# Altium schematic sheet Battery Pack & Charger.SchDoc
size A4
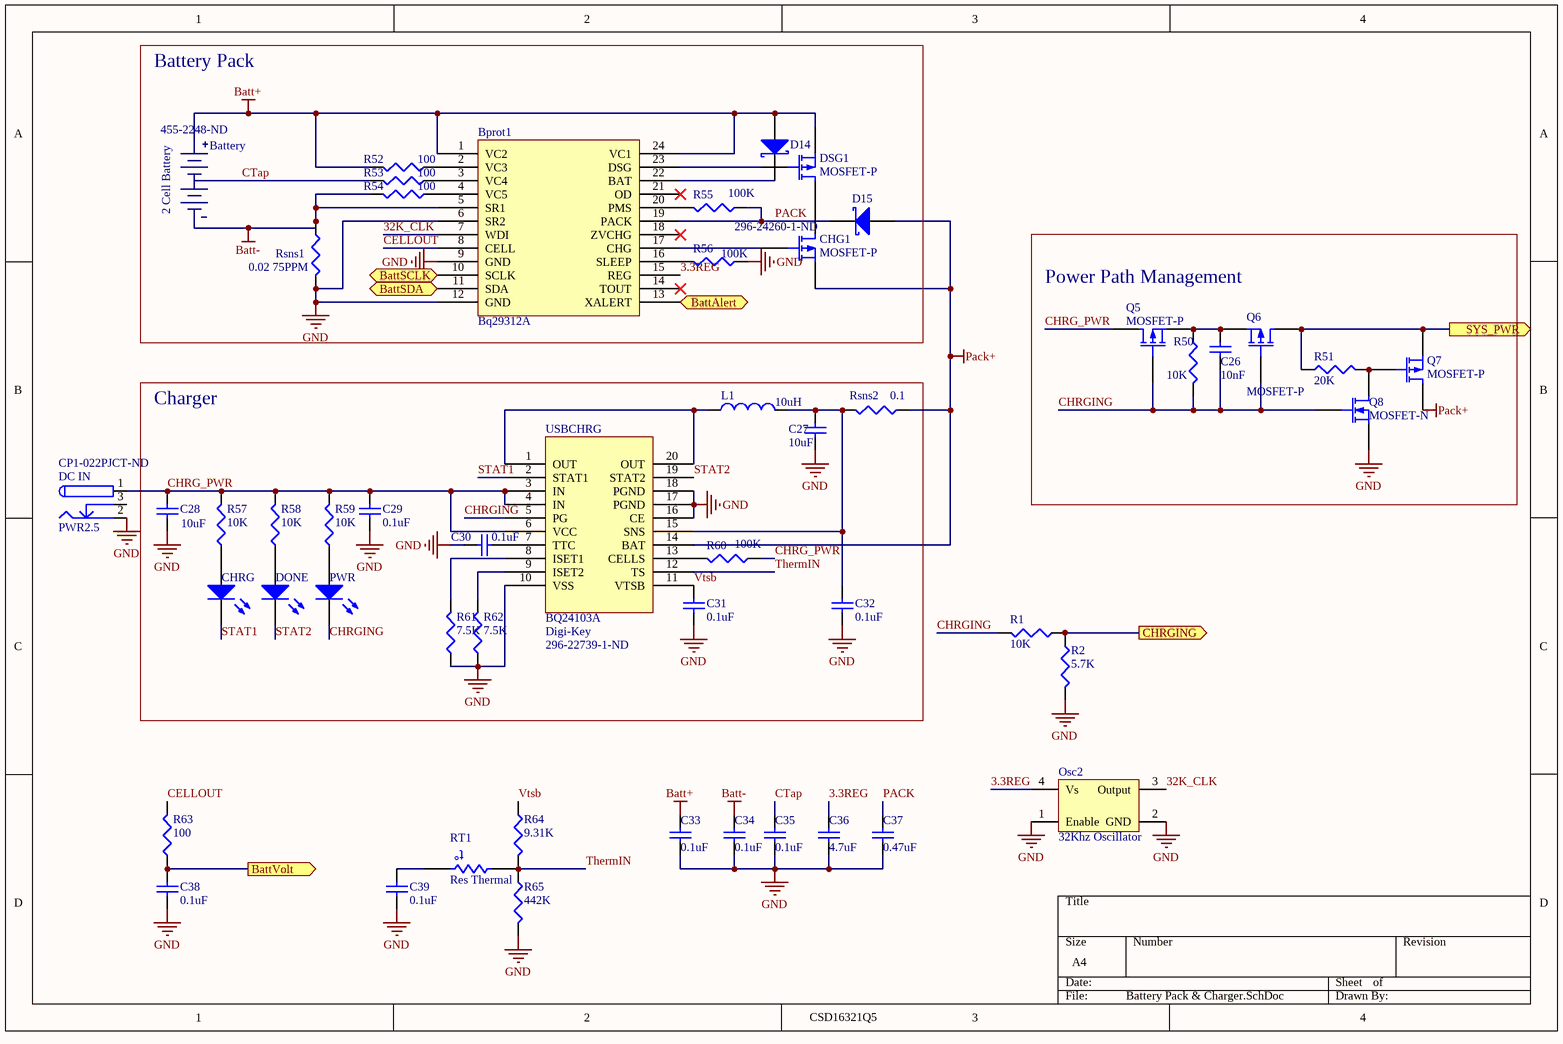
[diagram p0: Battery Pack & Charger.SchDoc]

## Parts
Battery  2 Cell Battery  Supplier Part Number 1: 455-2248-ND  [Turnigy Nanotech 2cell]
Bprot1  Bq29312A  [TSOP65P640X120-24N]
C26  value 10nF  [0603_CAP]  (hidden comment: X7R Cap)
C27  value 10uF  [0603_CAP]  (hidden comment: X7R Cap)
C28  value 10uF  [0603_CAP]  (hidden comment: X7R Cap)
C29  value 0.1uF  [0603_CAP]  (hidden comment: X7R Cap)
C30  value 0.1uF  [0603_CAP]  (hidden comment: X7R Cap)
C31  value 0.1uF  [0603_CAP]  (hidden comment: X7R Cap)
C32  value 0.1uF  [0603_CAP]  (hidden comment: X7R Cap)
C33  value 0.1uF  [0603_CAP]  (hidden comment: X7R Cap)
C34  value 0.1uF  [0603_CAP]  (hidden comment: X7R Cap)
C35  value 0.1uF  [0603_CAP]  (hidden comment: X7R Cap)
C36  value 4.7uF  [0603_CAP]  (hidden comment: X7R Cap)
C37  value 0.47uF  [0603_CAP]  (hidden comment: X7R Cap)
C38  value 0.1uF  [0603_CAP]  (hidden comment: X7R Cap)
C39  value 0.1uF  [0603_CAP]  (hidden comment: X7R Cap)
CHG1  MOSFET-P  [CSD16321Q5_PFET]
CHRG  LED0  [0603_RES]  (value not drawn)
D14  Diode 10TQ035  [DIODE]  (value not drawn)
D15  Diode 10TQ035  [DIODE]  (value not drawn)
DC_IN  PWR2.5  Supplier Part Number 1: CP1-022PJCT-ND  [DC Power JAck]
DONE  LED0  [0603_RES]  (value not drawn)
DSG1  MOSFET-P  [CSD16321Q5_PFET]
L1  value 10uH  [INDM7575X45N]  (hidden comment: Inductor)
Osc2  32Khz Oscillator  [Oscillator]
PWR  LED0  [0603_RES]  (value not drawn)
Q5  MOSFET-P  [CSD16321Q5_PFET]
Q6  MOSFET-P  [CSD16321Q5_PFET]
Q7  MOSFET-P  [CSD16321Q5_PFET]
Q8  MOSFET-N  [CSD16321Q5]
R1  value 10K  [0603_RES]  (hidden comment: Res3)
R2  value 5.7K  [0603_RES]  (hidden comment: Res3)
R50  value 10K  [0603_RES]  (hidden comment: Res3)
R51  value 20K  [0603_RES]  (hidden comment: Res3)
R52  value 100  [0603_RES]
R53  value 100  [0603_RES]
R54  value 100  [0603_RES]
R55  value 100K  [RESC1608L]
R56  value 100K  [RESC1608L]
R57  value 10K  [0603_RES]  (hidden comment: Res3)
R58  value 10K  [0603_RES]  (hidden comment: Res3)
R59  value 10K  [0603_RES]  (hidden comment: Res3)
R60  value 100K  [RESC1608L]
R61  value 7.5K  [0603_RES]
R62  value 7.5K  [0603_RES]
R63  value 100  [0603_RES]
R64  value 9.31K  [0603_RES]  (hidden comment: Rpull)
R65  value 442K  [0603_RES]  (hidden comment: Rpull)
Rsns1  value 0.02 75PPM  [CRA2512]
Rsns2  value 0.1  [CRA2512]  (hidden comment: Rpull)
RT1  Res Thermal  [RESC2012N]
USBCHRG  BQ24103A  Supplier 1: Digi-Key  [QFN50P350X450X100-20N]

## Blocks framed on the sheet
Battery Pack: Battery Bprot1 CHG1 D14 D15 DSG1 R52-R56 Rsns1
Power Path Management: C26 Q5-Q8 R50 R51
Charger: C27-C32 CHRG DONE L1 PWR R57-R62 Rsns2 USBCHRG

## Ports
BattAlert (out), BattSCLK (in), BattSDA (in), BattVolt (out), CHRGING (out), SYS_PWR (out)

## Nets
Batt+: Battery.1(+) Bprot1.1(VC2) Bprot1.24(VC1) C33.1 D14.1(A) DSG1.3(S) R52.2
Batt-: Battery.3(-) Bprot1.5(SR1) C34.1 R54.2 Rsns1.1
GND: Bprot1.6(SR2) Bprot1.9(GND) Bprot1.12(GND) C27.1 C28.1 C29.2 C30.1 C31.2 C32.2 C33.2 C34.2 C35.2 C36.2 C37.2 C38.1 C39.1 DC_IN.2 Osc2.1(Enable) Osc2.2(GND) Q8.3(S) R2.2 R56.1 R61.1 R62.1 R65.2 Rsns1.2 USBCHRG.10(VSS) USBCHRG.16(CE) USBCHRG.17(PGND) USBCHRG.18(PGND)
Pack+: CHG1.3(S) D15.2(A) Q7.1(D) Rsns2.1 USBCHRG.14(BAT)
3.3REG: Bprot1.15(REG) C36.1 Osc2.4(Vs)
32K_CLK: Bprot1.7(WDI) Osc2.3(Output)
BattAlert: Bprot1.13(XALERT) ; port BattAlert
BattSCLK: Bprot1.10(SCLK) ; port BattSCLK
BattSDA: Bprot1.11(SDA) ; port BattSDA
BattVolt: C38.2 R63.1 ; port BattVolt
CELLOUT: Bprot1.8(CELL) R63.2
CHRG_PWR: C28.2 C29.1 DC_IN.1 Q5.1(D) R57.2 R58.2 R59.2 R60.1 USBCHRG.3(IN) USBCHRG.4(IN) USBCHRG.6(VCC)
CHRGING: C26.1 PWR.2(K) Q5.2(G) Q6.2(G) Q8.2(G) R1.2 R50.2 USBCHRG.5(PG)
CHRGING: R1.1 R2.1 ; port CHRGING  [a separate net that carries the same name]
CTap: Battery.2(Ctap) C35.1 R53.2
PACK: Bprot1.19(PACK) C37.1 D15.1(K) R55.1
STAT1: CHRG.2(K) USBCHRG.2(STAT1)
STAT2: DONE.2(K) USBCHRG.19(STAT2)
SYS_PWR: Q6.1(D) Q7.3(S) R51.1 ; port SYS_PWR
ThermIN: R64.2 R65.1 RT1.2 USBCHRG.12(TS)
Vtsb: C31.1 R64.1 USBCHRG.11(VTSB)
NetBprot1_2: Bprot1.2(VC3) R52.1
NetBprot1_3: Bprot1.3(VC4) R53.1
NetBprot1_4: Bprot1.4(VC5) R54.1
NetBprot1_16: Bprot1.16(SLEEP) R56.2
NetBprot1_17: Bprot1.17(CHG) CHG1.2(G)
NetBprot1_20: Bprot1.20(PMS) R55.2
NetBprot1_22: Bprot1.22(BAT) D14.2(K)
NetBprot1_23: Bprot1.23(DSG) DSG1.2(G)
NetC26_2: C26.2 Q5.3(S) Q6.3(S) R50.1
NetC27_2: C27.2 C32.1 L1.2 Rsns2.2 USBCHRG.15(SNS)
NetC30_2: C30.2 USBCHRG.7(TTC)
NetC39_2: C39.2 RT1.1
NetCHG1_1: CHG1.1(D) DSG1.1(D)
NetCHRG_1: CHRG.1(A) R57.1
NetDONE_1: DONE.1(A) R58.1
NetL1_1: L1.1 USBCHRG.1(OUT) USBCHRG.20(OUT)
NetPWR_1: PWR.1(A) R59.1
NetQ7_2: Q7.2(G) Q8.1(D) R51.2
NetR60_2: R60.2 USBCHRG.13(CELLS)
NetR61_2: R61.2 USBCHRG.8(ISET1)
NetR62_2: R62.2 USBCHRG.9(ISET2)

Not connected (* = marked no-connect by the designer): Bprot1 14(TOUT)* 18(ZVCHG)* 21(OD)*; DC_IN 3

## Notes on the sheet
- CSD16321Q5
- (in symbol Res Thermal) t°

## Library data of the parts
Battery = 2 Cell Battery: Manufacturer: JST Sales America Inc; Manufacturer Part Number: B3B-XH-A  (LF)(SN)(P);; Description: CONN HEADER XH TOP 3POS 2.5MM; Connector Type: Header, Shrouded; Number of Positions: 3; Number of Positions Loaded: All; Pitch: 0.098" (2.50mm); Supplier 1: Digi-Key; RoHS: RoHS Compliant; Category: Connectors, Interconnects; Stock 1: 38279; Pricing 1: 1=0.12, 10=0.11, 100=0.0915, 500=0.07324, 1000=0.06079, 5000=0.05493, 10000=0.04871 (USD); Contact Type: Male Pin; Number of Rows: 1; Row Spacing: -; Contact Mating Length: -; Mounting Type: Through Hole; Termination: Press-Fit; Fastening Type: -; Features: -; Contact Finish: Tin; Contact Finish Thickness: -; Color: Natural; Packaging: Bulk; ComponentLink1URL: http://www.jst-mfg.com/product/pdf/eng/eXH.pdf; ComponentLink1Description: http://www.jst-mfg.com/product/pdf/eng/eXH.pdf
Bprot1 = Bq29312A: 296-19870-1-ND; Supplier 1: Digi-Key; Supplier Part Number 1: 296-19870-1-ND
C26-C39 = Cap: Capacitor; Published: 8-Jun-2000; LatestRevisionDate: 17-Jul-2002; LatestRevisionNote: Re-released for DXP Platform.; PackageReference: RAD-0.3; Publisher: Altium Limited
CHG1 DSG1 Q5-Q7 = MOSFET-P: 296-24260-1-ND; Manufacturer: Texas Instruments; Manufacturer Part Number: CSD25401Q3; Description: MOSFET P-CH 20V 60A 8-SON; FET Type: MOSFET P-Channel, Metal Oxide; FET Feature: Logic Level Gate; Rds On (Max) @ Id, Vgs: 11.7 mOhm @ 10A, 4.5V; Drain to Source Voltage (Vdss): 20V; Current - Continuous Drain (Id) @ 25° C: 60A; Vgs(th) (Max) @ Id: 1.2V @ 250µA; Gate Charge (Qg) @ Vgs: 12.3nC @ 4.5V; Input Capacitance (Ciss) @ Vds: 1400pF @ 10V; Power - Max: 2.8W; Published: 8-Jun-2000; LatestRevisionDate: 17-Jul-2002; LatestRevisionNote: Re-released for DXP Platform.; PackageVersion: 1995/1996; PackageReference: E3; Publisher: Altium Limited; Supplier 1: Digi-Key; Supplier Part Number 1: 296-24260-1-ND; RoHS: RoHS Compliant By Exemption; Category: Discrete Semiconductor Products; Stock 1: 15742; Pricing 1: 1=1.55, 25=1.2212, 100=1.0989, 250=0.95644, 500=0.8547, 1000=0.67155 (USD); Mounting Type: Surface Mount; Package / Case: 8-TDFN Exposed Pad; Supplier Device Package: 8-SON; Packaging: Cut Tape (CT); ComponentLink1URL: http://www.ti.com/lit/ds/symlink/csd25401q3.pdf; ComponentLink1Description: http://www.ti.com/lit/ds/symlink/csd25401q3.pdf
CHRG DONE PWR = LED0: Typical INFRARED GaAs LED; Published: 8-Jun-2000; LatestRevisionDate: 08-Jul-2005; LatestRevisionNote: Mech Layer 1 removed.; PackageReference: LED-0; Publisher: Altium Limited
D14 D15 = Diode 10TQ035: Schottky Rectifier; Manufacturer: ON Semiconductor; Manufacturer Part Number: MBRS320T3G; Note: Terminal 2 is the TAB and is electrically connected to the cathode; Description: DIODE SCHOTTKY 20V 4A SMC; Voltage - DC Reverse (Vr) (Max): 20V; Current - Average Rectified (Io): 4A; Voltage - Forward (Vf) (Max) @ If: 500mV @ 3A; Speed: Fast Recovery =< 500ns, > 200mA (Io); Current - Reverse Leakage @ Vr: 2mA @ 20V; Published: 8-Jun-2000; LatestRevisionDate: 17-Jul-2002; LatestRevisionNote: Re-released for DXP Platform.; DatasheetVersion: PD-2.057B; PackageVersion: Feb-1998; PackageReference: TO-220AC; Publisher: Altium Limited; ComponentLink1Description: Manufacturer Link; ComponentLink1URL: http://www.irf.com/; ComponentLink2Description: Datasheet; ComponentLink2URL: http://www.irf.com/product-info/datasheets/data/10tq.pdf; Supplier 1: Digi-Key; Supplier Part Number 1: MBRS320T3GOSCT-ND; RoHS: RoHS Compliant; Category: Discrete Semiconductor Products; Stock 1: 19790; Pricing 1: 1=0.8, 10=0.642, 100=0.4811, 250=0.41552, 500=0.35722, 1000=0.27702 (USD); Diode Type: Schottky; Reverse Recovery Time (trr): -; Capacitance @ Vr, F: -; Mounting Type: Surface Mount; Package / Case: DO-214AB, SMC; Supplier Device Package: SMCJ (DO-214AB); Packaging: Cut Tape (CT); ComponentLink3URL: http://www.onsemi.com/pub_link/Collateral/MBRS340T3-D.PDF; ComponentLink3Description: http://www.onsemi.com/pub_link/Collateral/MBRS340T3-D.PDF
DC_IN = PWR2.5: Low Voltage Power Supply Connector; Manufacturer: CUI Inc; Manufacturer Part Number: PJ1-022-SMT; Description: CONN PWR JACK DC 0.65X2.75MM SMD; Connector Type: Jack; Gender: Male; Plug/Mating Plug Diameter: 0.70mm ID, 2.35mm OD (EIAJ-1); Number of Positions/Contacts: 2 Conductors, 3 Contacts; Internal Switch(s): Single Switch, Normally Closed; Shielding: Unshielded; Voltage - Rated: 16VDC; Current Rating: 2.5A; Published: 17-Dec-2003; DatasheetDocument: 09-May-2002; Publisher: Altium Limited; ComponentLink1Description: Manufacturer Link; ComponentLink1URL: http://domino.kycon.com/internet/Products.html; Supplier 1: Digi-Key; RoHS: RoHS Compliant; Category: Connectors, Interconnects; Stock 1: 6275; Pricing 1: 1=1.34, 10=1.04, 100=0.7936, 500=0.6336 (USD); Mounting Type: Surface Mount, Right Angle; Termination: Solder; Features: -; Color: Black; Contact Material: Brass; Contact Material - Plating: Silver; Housing Color: Black; Housing Material: Thermoplastic; Operating Temperature: -; ComponentLink2URL: http://products.cui.com/GetSpecForDigiKey.aspx?MFGNum=PJ1-022-SMT; ComponentLink2Description: http://products.cui.com/GetSpecForDigiKey.aspx?MFGNum=PJ1-022-SMT
L1 = Inductor: 308-1502-1-ND; Manufacturer: SUMIDA AMERICA COMPONENTS INC; Manufacturer Part Number: CDRH74NP-100MC; Code_IEC: 1005; Description: POWER INDUCTOR 10UH 1.84A SMD; Inductance: 10µH; Current: 1.84A; Tolerance: ±20%; Shielding: Shielded; DC Resistance (DCR): 49 mOhm Max; Frequency - Test: 100kHz; Published: 8-Jun-2000; LatestRevisionDate: 29-May-2009; LatestRevisionNote: IPC-7351 Footprint Added.; PackageReference: 0402-A; Publisher: Altium Limited; PackageDescription: Chip Inductor; Code_JEITA: 0402; Supplier 1: Digi-Key; Supplier Part Number 1: 308-1502-1-ND; RoHS: RoHS Compliant; Category: Inductors, Coils, Chokes; Stock 1: 8641; Pricing 1: 1=1.42, 10=1.29, 50=1.16, 100=0.96, 250=0.8 (USD); Current - Saturation: -; Current - Temperature Rise: -; Type: -; Q @ Freq: -; Frequency - Self Resonant: -; Package / Case: 0.295" L x 0.295" W x 0.177" H (7.50mm x 7.50mm x 4.50mm); Mounting Type: Surface Mount; Packaging: Cut Tape (CT); Operating Temperature: -; Material - Core: -; Applications: Power Supplies; ComponentLink1URL: http://www.sumida.com/products/pdf/CDRH74.pdf; ComponentLink1Description: http://www.sumida.com/products/pdf/CDRH74.pdf
Osc2 = 32Khz_Oscillator: 535-9999-1-ND; Manufacturer: Abracon Corporation; Manufacturer Part Number: ASDK-32.768KHZ-LRT; Description: OSCILLATOR 32.768KHZ 3.3V SMD; Frequency: 32.768kHz; Function: Tri-State (Output Enable); Output: CMOS; Voltage - Supply: 3.3V; Frequency Stability: ±25ppm; Current - Supply (Max): 3.5mA; Supplier Part Number 1: 535-9999-1-ND; Supplier 1: Digi-Key; RoHS: RoHS Compliant; Category: Crystals and Oscillators; Stock 1: 2339; Pricing 1: 1=5.06, 10=4.388, 50=3.8476, 100=3.0375, 500=2.565 (USD); Type: XO (Standard); Operating Temperature: -40°C ~ 85°C; Mounting Type: Surface Mount; Size / Dimension: 0.098" L x 0.079" W (2.50mm x 2.00mm); Height: 0.037" (0.95mm); Package / Case: 4-SMD, No Lead (DFN, LCC); Packaging: Cut Tape (CT); Current - Supply (Disable) (Max): -; ComponentLink1URL: http://www.abracon.com/Oscillators/ASDK.pdf; ComponentLink1Description: http://www.abracon.com/Oscillators/ASDK.pdf
Q8 = MOSFET-N: 296-24517-1-ND; Manufacturer: Texas Instruments; Description: MOSFET N-CH 25V 100A 8-SON; FET Type: MOSFET N-Channel, Metal Oxide; FET Feature: Logic Level Gate; Rds On (Max) @ Id, Vgs: 2.4 mOhm @ 25A, 8V; Drain to Source Voltage (Vdss): 25V; Current - Continuous Drain (Id) @ 25° C: 100A; Vgs(th) (Max) @ Id: 1.4V @ 250µA; Gate Charge (Qg) @ Vgs: 19nC @ 4.5V; Input Capacitance (Ciss) @ Vds: 3100pF @ 12.5V; Power - Max: 3.1W; Published: 8-Jun-2000; LatestRevisionDate: 17-Jul-2002; LatestRevisionNote: Re-released for DXP Platform.; PackageVersion: 1995/1996; PackageReference: E3; Publisher: Altium Limited; Supplier 1: Digi-Key; Supplier Part Number 1: 296-24517-1-ND; Manufacturer Part Number: CSD16321Q5; RoHS: RoHS Compliant By Exemption; Category: Discrete Semiconductor Products; Stock 1: 8409; Pricing 1: 1=2.28, 25=1.7552, 100=1.5925, 250=1.43, 500=1.235, 1000=1.04 (USD); Mounting Type: Surface Mount; Package / Case: 8-TDFN Exposed Pad; Supplier Device Package: 8-SON; Packaging: Cut Tape (CT); ComponentLink1URL: http://www.ti.com/lit/ds/symlink/csd16321q5.pdf; ComponentLink1Description: http://www.ti.com/lit/ds/symlink/csd16321q5.pdf
R1 R2 R50-R62 = Res3: Resistor; Published: 8-Jun-2000; LatestRevisionDate: 29-May-2009; LatestRevisionNote: IPC-7351 Footprint Added.; PackageReference: J1-0603; Publisher: Altium Limited; PackageDescription: Chip Resistor
R63-R65 = Rpull: Resistor; Published: 8-Jun-2000; LatestRevisionDate: 29-May-2009; LatestRevisionNote: IPC-7351 Footprint Added.; PackageReference: J1-0603; Publisher: Altium Limited; PackageDescription: Chip Resistor
Rsns1 = Rpull: Resistor; Manufacturer: Bourns Inc.; Manufacturer Part Number: CRA2512-FZ-R020ELF; Description: RES .02 OHM 3W 1% 2512 SMD; Resistance (Ohms): 0.02; Power (Watts): 3W; Temperature Coefficient: ±75ppm/°C; Tolerance: ±1%; Published: 8-Jun-2000; LatestRevisionDate: 29-May-2009; LatestRevisionNote: IPC-7351 Footprint Added.; PackageReference: J1-0603; Publisher: Altium Limited; PackageDescription: Chip Resistor; Supplier 1: Digi-Key; Supplier Part Number 1: CRA2512-FZ-R020ELFCT-ND; RoHS: RoHS Compliant; Category: Resistors; Stock 1: 62600; Pricing 1: 1=0.49, 10=0.332, 50=0.299, 100=0.286, 250=0.26, 500=0.234, 1000=0.208 (USD); Composition: Metal Film; Features: Current Sense; Size / Dimension: 0.252" L x 0.126" W (6.40mm x 3.20mm); Height: 0.031" (0.80mm); Number of Terminations: 2; Packaging: Cut Tape (CT); Package / Case: 2512 (6432 Metric); ComponentLink1URL: http://www.bourns.com/data/global/PDFs/CRA.pdf; ComponentLink1Description: http://www.bourns.com/data/global/PDFs/CRA.pdf
Rsns2 = Rpull: Resistor; Manufacturer: Bourns Inc.; Manufacturer Part Number: CRA2512-FZ-R100ELF; Description: RES .10 OHM 3W 1% 2512 SMD; Power (Watts): 3W; Temperature Coefficient: ±75ppm/°C; Tolerance: ±1%; Published: 8-Jun-2000; LatestRevisionDate: 29-May-2009; LatestRevisionNote: IPC-7351 Footprint Added.; PackageReference: J1-0603; Publisher: Altium Limited; PackageDescription: Chip Resistor; Supplier 1: Digi-Key; Supplier Part Number 1: CRA2512-FZ-R100ELFCT-ND; RoHS: RoHS Compliant; Category: Resistors; Stock 1: 42912; Pricing 1: 1=0.49, 10=0.332, 50=0.299, 100=0.286, 250=0.26, 500=0.234, 1000=0.208 (USD); Resistance (Ohms): 0.1; Composition: Metal Film; Features: Current Sense; Size / Dimension: 0.252" L x 0.126" W (6.40mm x 3.20mm); Height: 0.031" (0.80mm); Number of Terminations: 2; Packaging: Cut Tape (CT); Package / Case: 2512 (6432 Metric); ComponentLink1URL: http://www.bourns.com/data/global/PDFs/CRA.pdf; ComponentLink1Description: http://www.bourns.com/data/global/PDFs/CRA.pdf
RT1 = Res Thermal: Thermistor; Published: 24-Mar-1999; LatestRevisionDate: 29-May-2009; LatestRevisionNote: IPC-7351 Footprint Added.; PackageVersion: Mar-2003; PackageReference: 6-0805; Publisher: Altium Limited; PackageDescription: Chip Resistor 0805 Case Size; Code_IPC: RESC2012
USBCHRG = Bq24103: 296-22739-1-ND; Supplier Part Number 1: 296-22739-1-ND